# Altium schematic sheet Memoria.SchDoc: CONTROLADORA AIRPOPCORN
size A3; DocumentNumber: 12; SheetNumber: 12; SheetTotal: 15
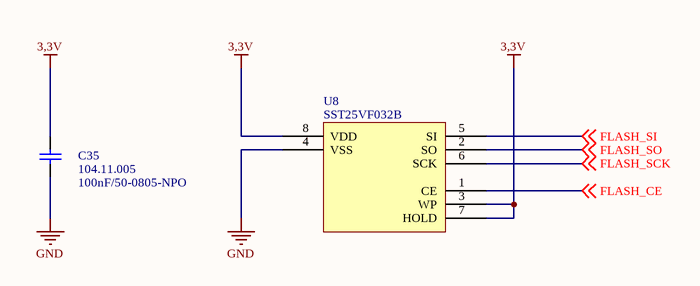
[diagram p0: Memoria.SchDoc]

## Parts
C35  100nF/50-0805-NPO  ERP: 104.11.005  [0805-REVISADO ONDA]
U8  SST25VF032B  [SOIC-08]

## Nets
3,3V: C35.2 U8.3(WP) U8.7(HOLD) U8.8(VDD)
GND: C35.1 U8.4(VSS)
FLASH_CE: U8.1(CE) ; off-sheet FLASH_CE
FLASH_SCK: U8.6(SCK) ; off-sheet FLASH_SCK
FLASH_SI: U8.5(SI) ; off-sheet FLASH_SI
FLASH_SO: U8.2(SO) ; off-sheet FLASH_SO

## Notes on the sheet
- NOME
- DATA
- PROJETO
- DESCRIÇÃO
- desenho
- verif.
- aprov.
- TAMANHO
- CODIGO
- Todas as informações disponíveis
- não devem ser divulgadas,
- em parte ou todo.
- CIRCUITO IMPRESSO
- MONTAGEM ELETRÔNICA
- A4
- de

## Library data of the parts
U8 = SST25VF032B: ERP: FALTA CADASTRAR